# EAGLE design NES Controller (EAGLE 9.2.2)
NES Controll NES-REC-000 v1
COMPANY: 6XGate Systems LLC; DOCNUM: NES-CTRL-001; DOCREV: 001
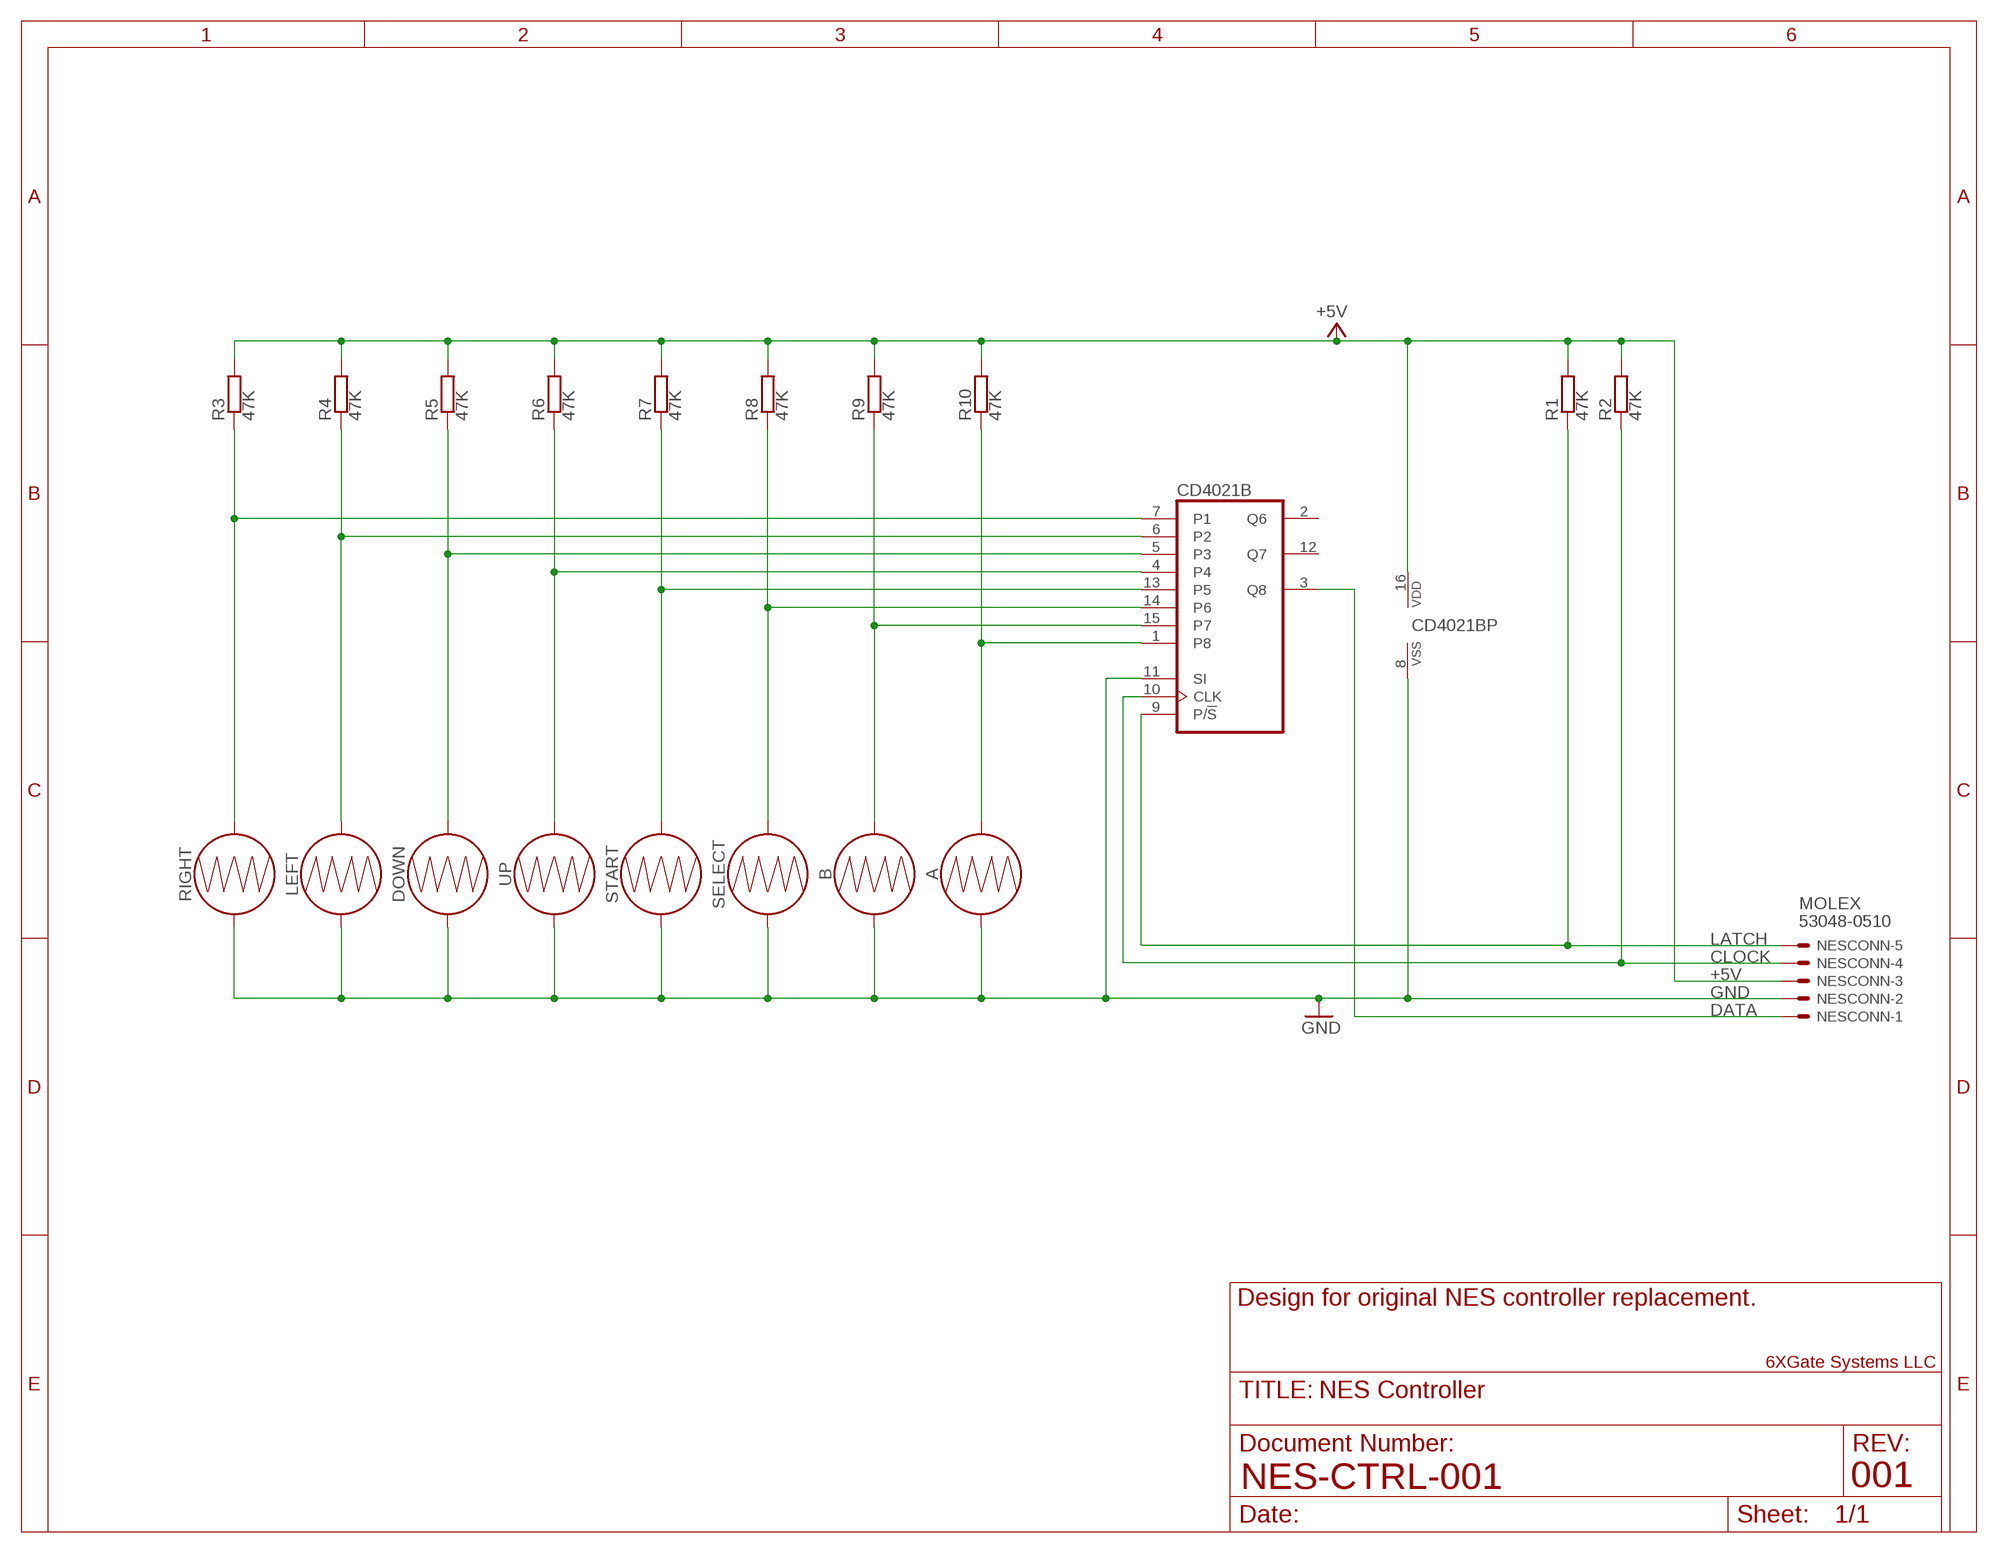
[diagram p0: schematic, sheet 1]

## Parts
A  BUTTON-CONDUCTIVESMD  [BUTTON-CONDUCTIVE]
B  BUTTON-CONDUCTIVESMD  [BUTTON-CONDUCTIVE]
CD4021B  4021D  [SO16]
DOWN  BUTTON-CONDUCTIVESMD  [BUTTON-CONDUCTIVE]
LEFT  BUTTON-CONDUCTIVESMD  [BUTTON-CONDUCTIVE]
NESCONN  53048-05  [53048-05]
R1  47K  R-EU_R0805  [R0805]
R2  47K  R-EU_R0805  [R0805]
R3  47K  R-EU_R0805  [R0805]
R4  47K  R-EU_R0805  [R0805]
R5  47K  R-EU_R0805  [R0805]
R6  47K  R-EU_R0805  [R0805]
R7  47K  R-EU_R0805  [R0805]
R8  47K  R-EU_R0805  [R0805]
R9  47K  R-EU_R0805  [R0805]
R10  47K  R-EU_R0805  [R0805]
RIGHT  BUTTON-CONDUCTIVESMD  [BUTTON-CONDUCTIVE]
SELECT  BUTTON-CONDUCTIVESMD  [BUTTON-CONDUCTIVE]
START  BUTTON-CONDUCTIVESMD  [BUTTON-CONDUCTIVE]
UP  BUTTON-CONDUCTIVESMD  [BUTTON-CONDUCTIVE]

## Nets
+5V [power]: CD4021B.16(VDD) NESCONN.3 R1.2 R2.2 R3.2 R4.2 R5.2 R6.2 R7.2 R8.2 R9.2 R10.2
A: A.1 CD4021B.1(P8) R10.1
B: B.1 CD4021B.15(P7) R9.1
CLOCK: CD4021B.10(CLK) NESCONN.4 R2.1
DATA: CD4021B.3(Q8) NESCONN.1
DOWN: CD4021B.5(P3) DOWN.2 R5.1
GND [ground]: A.2 B.2 CD4021B.8(VSS) CD4021B.11(SI) DOWN.1 LEFT.2 NESCONN.2 RIGHT.1 SELECT.2 START.1 UP.1
LATCH: CD4021B.9(P/!S) NESCONN.5 R1.1
LEFT: CD4021B.6(P2) LEFT.1 R4.1
RIGHT: CD4021B.7(P1) R3.1 RIGHT.2
SELECT: CD4021B.14(P6) R8.1 SELECT.1
START: CD4021B.13(P5) R7.1 START.2
UP: CD4021B.4 R6.1 UP.2
Unconnected: CD4021B.2(Q6) CD4021B.12(Q7)

## Notes on the sheet
- Design for original NES controller replacement.

## Library data of the parts
A B DOWN LEFT RIGHT SELECT START UP = SparkFun-Switches:BUTTON-CONDUCTIVE: Conductive Button Used with rubber key pads on the Nordic Key FOB <https://www.sparkfun.com/products/retired/8602>. This one was designed and proven to work with the PolyCase Key FOB enclosures <https://www.sparkfun.com/products/retired/9377>. SparkFun Products Nordic Fob <https://www.sparkfun.com/products/retired/8602> (WRL-08602)
CD4021B = 40xx:4021: 8-bit static SHIFT REGISTER
NESCONN = con-molex:53?-05: CONNECTOR wire to board 1.25 mm (.049 inch) pitch header; MF: MOLEX; MPN: 53048-0510; OC_FARNELL: 9732926; OC_NEWARK: 57H4722
R1-R10 = rcl:R-EU_: RESISTOR, European symbol; SPICEPREFIX: R

## Net classes
0 signal: width 0.5 mm, drill 0.35 mm, clearance 0.025 mm
1 power: width 0.5 mm, drill 0.35 mm, clearance 0.025 mm
2 ground: width 0.5 mm, drill 0.35 mm, clearance 0.025 mm

## Board
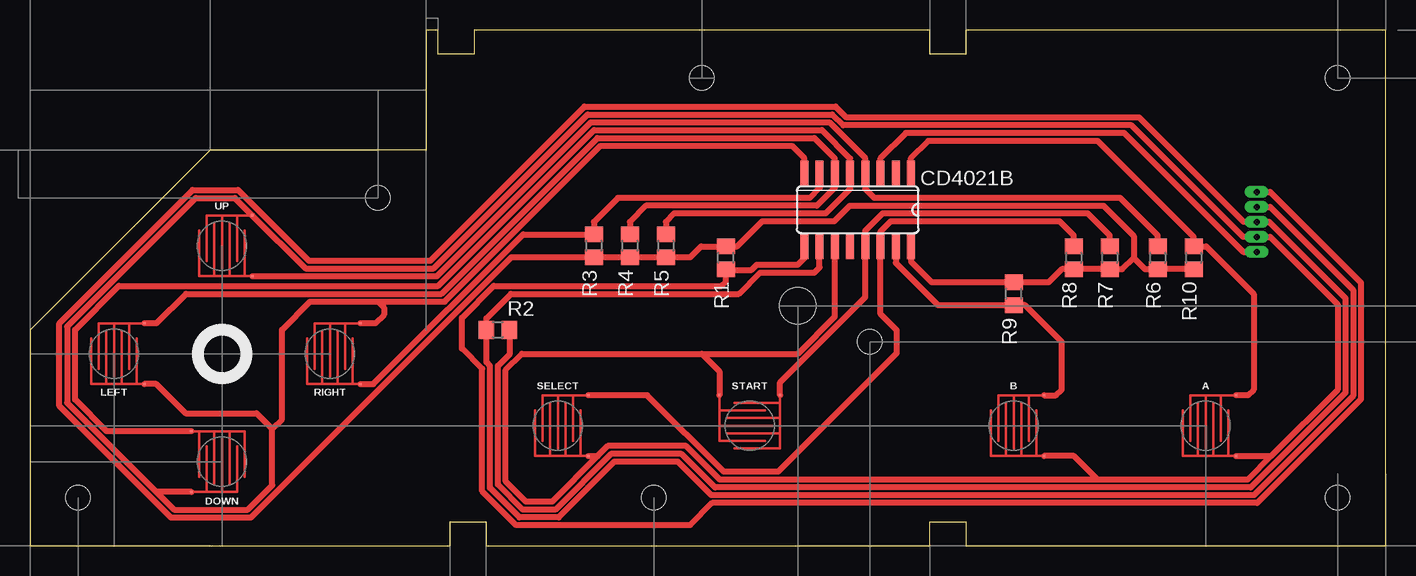
[diagram p1: board, top side]
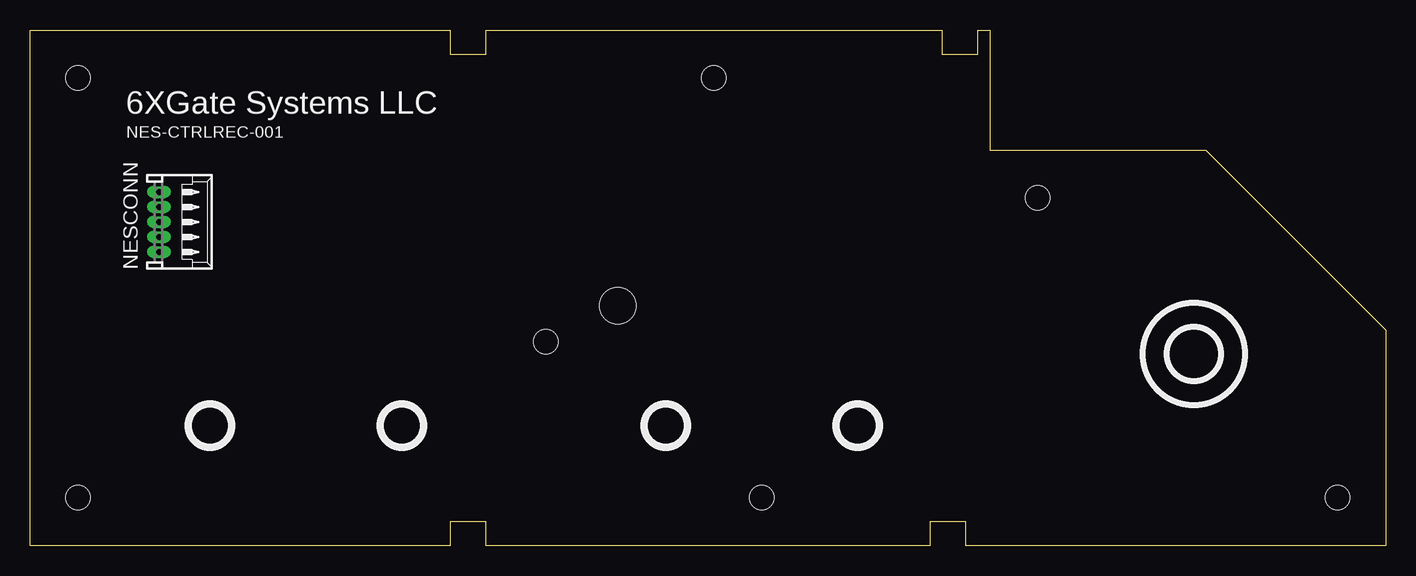
[diagram p2: board, bottom side, seen from below]

Size 113 x 43 mm. Coordinates in mm from the lower left corner, seen from the top.
Outline: 0,0 35,0 35,2 38,2 38,0 75,0 75,2 78,2 78,0 113,0 113,43 78,43 78,41 75,41 75,43 37,43 37,41 34,41 34,43 33,43 33,33 15,33 0,18 0,0
Copper layers (1*16): Top 0.035mm / dielectric 1.5mm / Bottom 0.035mm
Design rules "default": minimum track width 6mil, minimum drill 0.35mm, track to track 6mil, track to pad 6mil, pad to pad 6mil, via to via 6mil, smd to smd 6mil, copper to edge 40mil, drill to drill 6mil, minimum pad ring 10mil, minimum via ring 8mil, stop-mask expansion 4mil, vias tented up to drill 0mil, thermal gap 10mil
Holes 2 mm at 4,4 52,4 109,4 29,29 56,39 109,39 70,17
Holes 3 mm at 64,20

### Footprints (pad centres in the part's own frame; a part is rotated, then mirrored left to right if it is on the bottom)
BUTTON-CONDUCTIVE = smd 0.203 x 0.203: 1 2.54,2.54; 2 2.54,-2.54
SO16 = smd 0.66 x 2.032: 1 -4.445,-3.073; 2 -3.175,-3.073; 3 -1.905,-3.073; 4 -0.635,-3.073; 5 0.635,-3.073; 6 1.905,-3.073; 7 3.175,-3.073; 8 4.445,-3.073; 9 4.445,3.073; 10 3.175,3.073; 11 1.905,3.073; 12 0.635,3.073; 13 -0.635,3.073; 14 -1.905,3.073; 15 -3.175,3.073; 16 -4.445,3.073
53048-05 = drill 0.5 pad 0.698 long: 1 2.5,-1.25; 2 1.25,-1.25; 3 0,-1.25; 4 -1.25,-1.25; 5 -2.5,-1.25
R0805 = smd 1.3 x 1.5: 1 -0.95,0; 2 0.95,0

### Placement (x,y rotation side)
A  98,10 0 top
B  82,10 0 top
CD4021B  69,28 180 top
DOWN  16,7 180 top
LEFT  7,16 0 top
NESCONN  101,27 270 bottom
R1  58,24 90 top
R2  39,18 0 top
R3  47,25 270 top
R4  50,25 270 top
R5  53,25 270 top
R6  94,24 270 top
R7  90,24 270 top
R8  87,24 270 top
R9  82,21 90 top
R10  97,24 270 top
RIGHT  25,16 0 top
SELECT  44,10 0 top
START  60,10 90 top
UP  16,25 0 top

### Tracks (layer width: path | path; a pad name or v marks a point on that pad's centre or on a via)
+5V
  Top 0.5: R10.2 R6.2 92.95,23.05 92,24 | R2.2 40,17.95 40,16 39,15 39,5.08 41.08,3 43.8,3 48.44,7.64 54.31,7.64 57.11,4.85 101.77,4.85 109.65,12.73 109.65,20.64 103.3,27 NESCONN.3 101.17,27 92.47,35.71 68.07,35.71 67.17,36.61 46.23,36.61 33.38,23.77 23.24,23.77 17.35,29.65 13.56,29.65 2.44,18.54 2.44,11.63 11.73,2.35 18.43,2.35 40.13,24.05 R3.2 R4.2 R5.2 55.05,24.05 55.95,24.95 R1.2 58.95,24.95 61.04,27.04 67.04,27.04 68.35,28.35 89.48,28.35 92,25.83 92,24 | 92,24 91.05,23.05 R7.2 R8.2 86,23.05 84.9,21.95 R9.2 75.17,21.95 73.44,23.68 CD4021B.16
A
  Top 0.5: A.1 101.54,12.54 102,13 102,21 98.05,24.95 R10.1 97,25.75 89,33.75 74.88,33.75 73.44,32.32 CD4021B.1
B
  Top 0.5: B.1 85.54,12.54 86,13 86,17 82.95,20.05 R9.1 75.7,20.05 72.17,23.57 CD4021B.15
CLOCK
  Top 0.5: NESCONN.4 103.38,28.25 110.31,21.32 110.31,12.46 102.04,4.2 56.8,4.2 54.01,6.99 48.71,6.99 44.07,2.35 40.81,2.35 38.35,4.81 38.35,15 38.05,15.3 R2.1 38.05,18.95 40.1,21 59.09,21 60.85,22.77 65.39,22.77 65.83,23.2 CD4021B.10
DATA
  Top 0.5: NESCONN.1 101.12,24.5 91.22,34.4 73,34.4 70.91,32.31 CD4021B.3
DOWN
  Top 0.5: DOWN.2 6.38,9.54 3.75,12.17 3.75,18 7.4,21.65 34.04,21.65 47.04,34.65 66,34.65 68.36,32.29 CD4021B.5 68.36,29.74 66.32,27.7 53.7,27.7 53,27 R5.1
GND
  Top 0.5: 103.46,7.46 109,13 109,20.12 103.38,25.75 NESCONN.2 101.12,25.75 91.82,35.05 67.8,35.05 66.89,35.96 46.5,35.96 33.65,23.11 22.97,23.11 UP.1 17.08,29 13.83,29 3.1,18.27 3.1,11.9 10.54,4.46 | 103.46,7.46 101.5,5.5 89,5.5 | 89,5.5 57.5,5.5 54.71,8.29 48.17,8.29 47.33,7.46 | 47.33,7.46 43.52,3.65 41.35,3.65 39.65,5.35 39.65,14.65 41,16 56,16 | 10.54,4.46 12,3 18.16,3 20.19,5.04 20.19,9.73 | 29,20.35 23.35,20.35 21,18 21,10.54 20.19,9.73 | 29,20.35 29.5,19.85 29.5,19.25 28.79,18.54 RIGHT.1 | 20.19,9.73 18.89,11.03 12.97,11.03 10.54,13.46 LEFT.2 | 29,20.35 34.58,20.35 47.58,33.35 63.5,33.35 64.56,32.29 CD4021B.8 | DOWN.1 10.54,4.46 | 89,5.5 87.04,7.46 B.2 | 56,16 64,16 67.09,19.09 CD4021B.11 | SELECT.2 47.33,7.46 | 56,16 57.46,14.54 START.1 | A.2 103.46,7.46
LATCH
  Top 0.5: NESCONN.5 103.38,29.5 110.96,21.92 110.96,12.19 102.31,3.54 56.87,3.54 55.02,1.7 40.54,1.7 37.7,4.54 37.7,14.73 36,16.43 36,19 38.65,21.65 57.65,21.65 58,22 R1.1 58.05,23 60.17,23 60.58,23.42 64,23.42 64.56,23.97 CD4021B.9
LEFT
  Top 0.5: LEFT.1 10.54,18.54 13,21 34.31,21 47.31,34 65.38,34 67.09,32.28 CD4021B.6 67.09,29.84 65.6,28.35 51.35,28.35 50,27 R4.1
RIGHT
  Top 0.5: RIGHT.2 28.61,13.46 41.1,25.95 R3.1 47,27 49,29 65,29 65.83,29.82 CD4021B.7
SELECT
  Top 0.5: SELECT.1 51.46,12.54 57.84,6.15 62.36,6.15 72.27,16.06 72.27,17.94 70.91,19.3 CD4021B.14 70.91,26.2 71.75,27.04 85.83,27.04 87,25.88 R8.1
START
  Top 0.5: START.2 62.54,13.62 69.64,20.71 CD4021B.13 69.64,26.26 71.07,27.7 88.18,27.7 90,25.88 R7.1
UP
  Top 0.5: UP.2 33.92,22.46 46.77,35.3 66.62,35.3 69.64,32.3 CD4021B.4 69.64,29.74 70.38,29 90.88,29 94,25.88 R6.1